# Altium schematic sheet Peryferia.SchDoc: Płytka rozwojowa STM
size A3; Author1: Łukasz Wawrzyniak; Organization: Politechnika Łódzka; Address1: WEEIA; Address2: Elektronika i Telekomunikacja; Address3: Semestr zimowy 2021/2022; Address4: Stopień II; Revision: -; SheetNumber: 7; SheetTotal: 7; Author2: Mateusz Melka; Title2: Zaawansowane narzędzia CAD/EDA; Author3: Jakub Korzeniowski; Author4: Michał Skurpel; Author5: Maciej Figiel; Index1: 239499; Index2: 239488; Index3: 239436; Index4: 239457; Index5: 239473
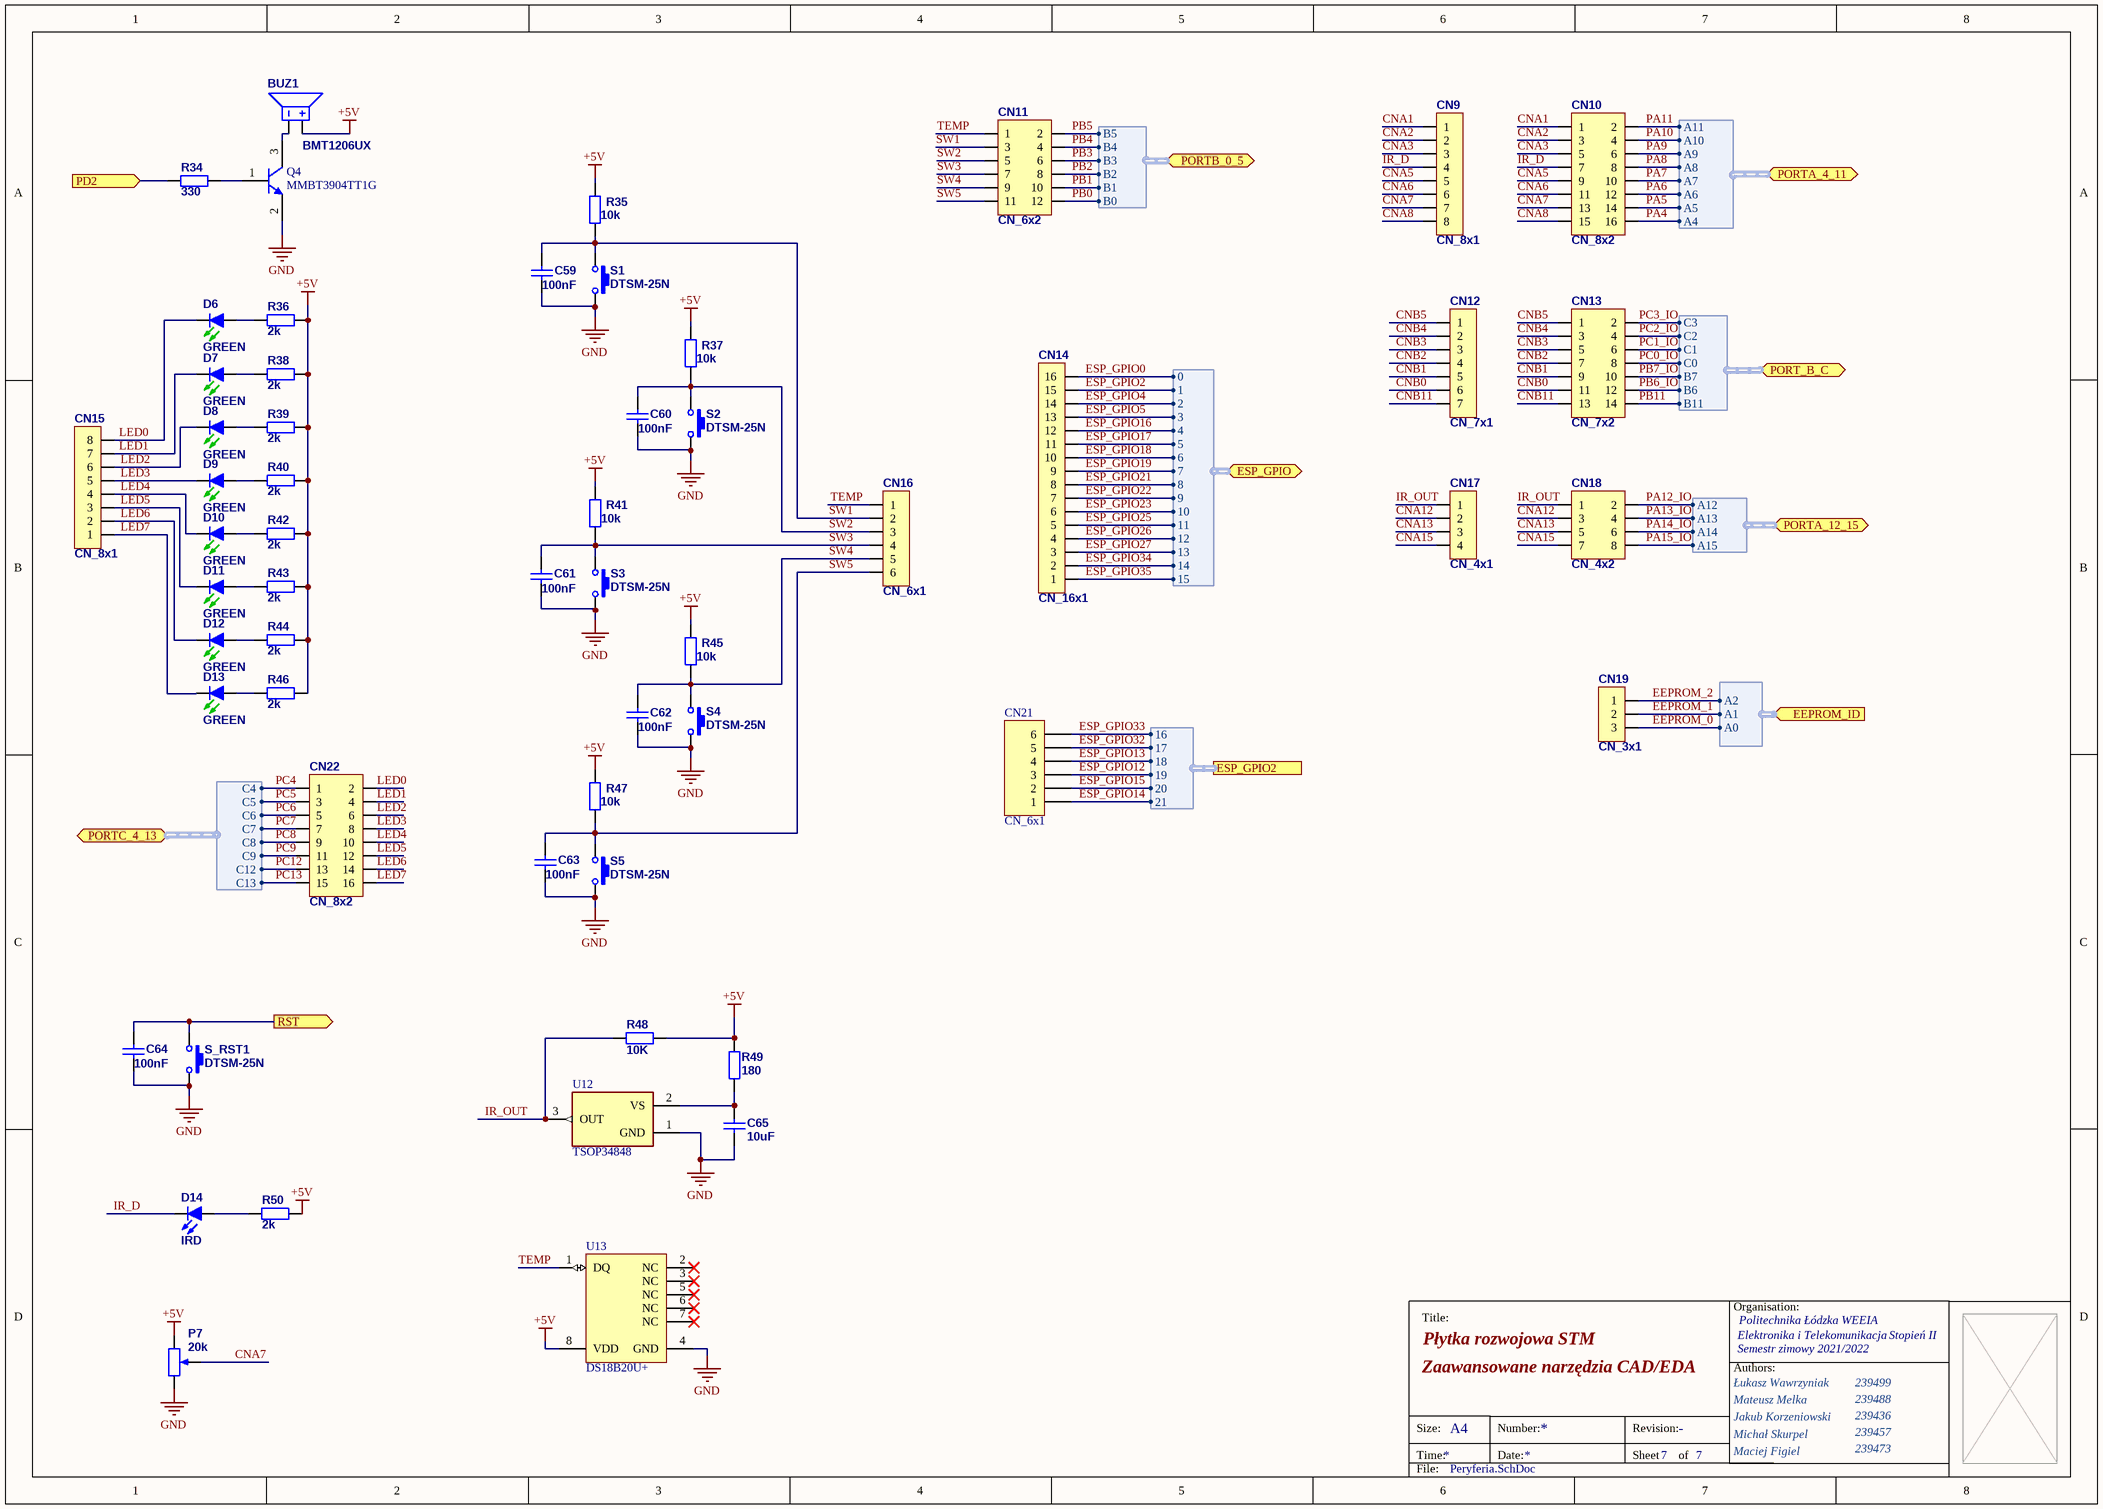
[diagram p0: Peryferia.SchDoc]

## Parts
BUZ1  BMT1206UX  [Buzzer - LD-BZEG-1305]
C59  100nF  [0805]
C60  100nF  [0805]
C61  100nF  [0805]
C62  100nF  [0805]
C63  100nF  [0805]
C64  100nF  [0805]
C65  10uF  [0805]
CN9  CN_8x1  [GP_8x1]
CN10  CN_8x2  [GP_8x2]
CN11  CN_6x2  [GP_6x2]
CN12  CN_7x1  [GP_7x1]
CN13  CN_7x2  [GP_7x2]
CN14  CN_16x1  [GP_16x1]
CN15  CN_8x1  [GP_8x1]
CN16  CN_6x1  [GP_6x1]
CN17  CN_4x1  [GP_4x1]
CN18  CN_4x2  [GP_4x2]
CN19  CN_3x1  [GP_3x1]
CN21  CN_6x1  [HDR1X6]
CN22  CN_8x2  [GP_8x2]
D6  GREEN  [LED1206G]
D7  GREEN  [LED1206G]
D8  GREEN  [LED1206G]
D9  GREEN  [LED1206G]
D10  GREEN  [LED1206G]
D11  GREEN  [LED1206G]
D12  GREEN  [LED1206G]
D13  GREEN  [LED1206G]
D14  IRD  [LED-Polarized]
P7  20k  [3305SMD]
Q4  MMBT3904TT1G  [ONSC-SC-75-3-463-01_V]
R34  330  [0805]
R35  10k  [0805]
R36  2k  [0805]
R37  10k  [0805]
R38  2k  [0805]
R39  2k  [0805]
R40  2k  [0805]
R41  10k  [0805]
R42  2k  [0805]
R43  2k  [0805]
R44  2k  [0805]
R45  10k  [0805]
R46  2k  [0805]
R47  10k  [0805]
R48  10K  [0805]
R49  180  [0805]
R50  2k  [0805]
S1  DTSM-25N  [DTSM-25N]
S2  DTSM-25N  [DTSM-25N]
S3  DTSM-25N  [DTSM-25N]
S4  DTSM-25N  [DTSM-25N]
S5  DTSM-25N  [DTSM-25N]
S_RST1  DTSM-25N  [DTSM-25N]
U12  TSOP34848  [Vishay_TSOP34838_0]
U13  DS18B20U+  [MAXM-U8+1_L]

## Ports
EEPROM_ID (in, harness Wyprowadzenia adresowe EEPROM), ESP_GPIO2 (harness GPIO ESP2), ESP_GPIO (bidir, harness GPIO ESP), PD2 (in), PORT_B_C (bidir, harness PORT_B_C), PORTA_4_11 (bidir, harness PORTA 4 11), PORTA_12_15 (bidir, harness PORTA 12 15), PORTB_0_5 (bidir, harness PORTB 0 5), PORTC_4_13 (bidir, harness PORTC 4 13), RST (out)

## Harnesses
PORTB 0 5: B0, B1, B2, B3, B4, B5
PORTC 4 13: C4, C5, C6, C7, C8, C9, C12, C13
PORTA 4 11: A4, A5, A6, A7, A8, A9, A10, A11
PORTA 12 15: A12, A13, A14, A15
Wyprowadzenia adresowe EEPROM: A0, A1, A2
GPIO ESP: 0, 1, 2, 3, 4, 5, 6, 7, 8, 9, 10, 11, 12, 13, 14, 15
PORT_B_C: B6, B7, C0, C1, C2, C3, B11
GPIO ESP2: 16, 17, 18, 19, 20, 21

## Nets
+5V: BUZ1.1 P7.2(BOT) R35.1 R36.1 R37.1 R38.1 R39.1 R40.1 R41.1 R42.1 R43.1 R44.1 R45.1 R46.1 R47.1 R48.1 R49.2 R50.1 U13.8(VDD)
GND: C59.2 C60.2 C61.2 C62.2 C63.2 C64.2 C65.1 P7.1(TOP) Q4.2(E) S1.2 S2.2 S3.2 S4.2 S5.2 S_RST1.2 U12.1(GND) U13.4(GND)
CNA1: CN9.1 CN10.1
CNA2: CN9.2 CN10.3
CNA3: CN9.3 CN10.5
CNA5: CN9.5 CN10.9
CNA6: CN9.6 CN10.11
CNA7: CN9.7 CN10.13 P7.3(TAP)
CNA8: CN9.8 CN10.15
CNA12: CN17.2 CN18.3
CNA13: CN17.3 CN18.5
CNA15: CN17.4 CN18.7
CNB0: CN12.6 CN13.11
CNB1: CN12.5 CN13.9
CNB2: CN12.4 CN13.7
CNB3: CN12.3 CN13.5
CNB4: CN12.2 CN13.3
CNB5: CN12.1 CN13.1
CNB11: CN12.7 CN13.13
EEPROM_0: CN19.3 ; port EEPROM_ID.A0
EEPROM_1: CN19.2 ; port EEPROM_ID.A1
EEPROM_2: CN19.1 ; port EEPROM_ID.A2
ESP_GPIO0: CN14.16 ; port ESP_GPIO.0
ESP_GPIO2: CN14.15 ; port ESP_GPIO.1
ESP_GPIO4: CN14.14 ; port ESP_GPIO.2
ESP_GPIO5: CN14.13 ; port ESP_GPIO.3
ESP_GPIO12: CN21.3 ; port ESP_GPIO2.19
ESP_GPIO13: CN21.4 ; port ESP_GPIO2.18
ESP_GPIO14: CN21.1 ; port ESP_GPIO2.21
ESP_GPIO15: CN21.2 ; port ESP_GPIO2.20
ESP_GPIO16: CN14.12 ; port ESP_GPIO.4
ESP_GPIO17: CN14.11 ; port ESP_GPIO.5
ESP_GPIO18: CN14.10 ; port ESP_GPIO.6
ESP_GPIO19: CN14.9 ; port ESP_GPIO.7
ESP_GPIO21: CN14.8 ; port ESP_GPIO.8
ESP_GPIO22: CN14.7 ; port ESP_GPIO.9
ESP_GPIO23: CN14.6 ; port ESP_GPIO.10
ESP_GPIO25: CN14.5 ; port ESP_GPIO.11
ESP_GPIO26: CN14.4 ; port ESP_GPIO.12
ESP_GPIO27: CN14.3 ; port ESP_GPIO.13
ESP_GPIO32: CN21.5 ; port ESP_GPIO2.17
ESP_GPIO33: CN21.6 ; port ESP_GPIO2.16
ESP_GPIO34: CN14.2 ; port ESP_GPIO.14
ESP_GPIO35: CN14.1 ; port ESP_GPIO.15
IR_D: CN9.4 CN10.7 D14.2(K)
IR_OUT: CN17.1 CN18.1 R48.2 U12.3(OUT)
LED0: CN15.8 CN22.2 D6.2(K)
LED1: CN15.7 CN22.4 D7.2(K)
LED2: CN15.6 CN22.6 D8.2(K)
LED3: CN15.5 CN22.8 D9.2(K)
LED4: CN15.4 CN22.10 D10.2(K)
LED5: CN15.3 CN22.12 D11.2(K)
LED6: CN15.2 CN22.14 D12.2(K)
LED7: CN15.1 CN22.16 D13.2(K)
PA4: CN10.16 ; port PORTA_4_11.A4
PA5: CN10.14 ; port PORTA_4_11.A5
PA6: CN10.12 ; port PORTA_4_11.A6
PA7: CN10.10 ; port PORTA_4_11.A7
PA8: CN10.8 ; port PORTA_4_11.A8
PA9: CN10.6 ; port PORTA_4_11.A9
PA10: CN10.4 ; port PORTA_4_11.A10
PA11: CN10.2 ; port PORTA_4_11.A11
PA12_IO: CN18.2 ; port PORTA_12_15.A12
PA13_IO: CN18.4 ; port PORTA_12_15.A13
PA14_IO: CN18.6 ; port PORTA_12_15.A14
PA15_IO: CN18.8 ; port PORTA_12_15.A15
PB0: CN11.12 ; port PORTB_0_5.B0
PB1: CN11.10 ; port PORTB_0_5.B1
PB2: CN11.8 ; port PORTB_0_5.B2
PB3: CN11.6 ; port PORTB_0_5.B3
PB4: CN11.4 ; port PORTB_0_5.B4
PB5: CN11.2 ; port PORTB_0_5.B5
PB6_IO: CN13.12 ; port PORT_B_C.B6
PB7_IO: CN13.10 ; port PORT_B_C.B7
PB11: CN13.14 ; port PORT_B_C.B11
PC0_IO: CN13.8 ; port PORT_B_C.C0
PC1_IO: CN13.6 ; port PORT_B_C.C1
PC2_IO: CN13.4 ; port PORT_B_C.C2
PC3_IO: CN13.2 ; port PORT_B_C.C3
PC4: CN22.1 ; port PORTC_4_13.C4
PC5: CN22.3 ; port PORTC_4_13.C5
PC6: CN22.5 ; port PORTC_4_13.C6
PC7: CN22.7 ; port PORTC_4_13.C7
PC8: CN22.9 ; port PORTC_4_13.C8
PC9: CN22.11 ; port PORTC_4_13.C9
PC12: CN22.13 ; port PORTC_4_13.C12
PC13: CN22.15 ; port PORTC_4_13.C13
PD2: R34.1 ; port PD2
RST: C64.1 S_RST1.1 ; port RST
SW1: C59.1 CN11.3 CN16.2 R35.2 S1.1
SW2: C60.1 CN11.5 CN16.3 R37.2 S2.1
SW3: C61.1 CN11.7 CN16.4 R41.2 S3.1
SW4: C62.1 CN11.9 CN16.5 R45.2 S4.1
SW5: C63.1 CN11.11 CN16.6 R47.2 S5.1
TEMP: CN11.1 CN16.1 U13.1(DQ)
NetBUZ1_2: BUZ1.2 Q4.3(C)
NetC65_2: C65.2 R49.1 U12.2(VS)
NetD6_1: D6.1(A) R36.2
NetD7_1: D7.1(A) R38.2
NetD8_1: D8.1(A) R39.2
NetD9_1: D9.1(A) R40.2
NetD10_1: D10.1(A) R42.2
NetD11_1: D11.1(A) R43.2
NetD12_1: D12.1(A) R44.2
NetD13_1: D13.1(A) R46.2
NetD14_1: D14.1(A) R50.2
NetQ4_1: Q4.1(B) R34.2

Not connected (* = marked no-connect by the designer): U13 2(NC)* 3(NC)* 5(NC)* 6(NC)* 7(NC)*

## Notes on the sheet
- Title:
- Organisation:
- Authors:
- Size:
- Time:
- A4
- Number:
- Date:
- Revision:
- Sheet
- of
- File:

## Library data of the parts
BUZ1 = BMT1206UX: Buzzer
C59-C65 = Cap: Capacitor; ComponentLink1Description: datasheet; ComponentLink2Description: supplier
  C59-C64: Value: 100nF
  C65: Value: 10uF
CN21 = Header 6: Header, 6-Pin; LatestRevisionDate: 17-Jul-2002; LatestRevisionNote: Re-released for DXP Platform.; Publisher: Altium Limited
D6-D13 = LED_GREEN: GREEN LED; Product Nr: KP-3216SGD; Voltage: 2,2-2,5V; Light Angle: 120; Brightness: 3,2÷12,5mcd; Current: 20mA; Published: 04-Apr-2006; Supplier: KINGBRIGHT ELECTRONIC
D14 = LED: Typical RED, GREEN, YELLOW, AMBER GaAs LED; Published: 04-Apr-2006
P7 = 3305SMD-10K: Published: 21-10-2009; ComponentLink1Description: datasheet; ComponentLink2Description: supplier; Value: 20k
Q4 = CMP-1048-00420-1: General Purpose Transistor, NPN Silicon, 3-Pin SC-75, Pb-Free, Tape and Reel; Manufacturer: On Semiconductor; IC Continuous (A): 0.2; fT Min (MHz): 300; ComponentLink3URL: http://www.onsemi.com/pub_link/Collateral/463-01.PDF; DatasheetVersion: Rev. 5; RoHS: TRUE; Mounting Technology: Surface Mount; ComponentLink1URL: http://www.onsemi.com/; ComponentLink3Description: Package Specification; PackageReference: SC-75-3-463-01; Polarity: NPN; ComponentLink2Description: Datasheet; PackageVersion: Rev. F, 07/2005; PartNumber: MMBT3904TT1G; ComponentLink2URL: http://www.onsemi.cn/pub_link/Collateral/MMBT3904TT1-D.PDF; ComponentLink1Description: Manufacturer URL; PackageDescription: 3-Pin Small Outline Transistor, Body 1.6 x 0.8 mm, Pitch 0.5 mm; Packing: Tape and Reel
R34-R50 = Res: Resistor; Published: 19-Feb-2006; ComponentLink1Description: datasheet; ComponentLink2Description: supplier
  R34: Value: 330
  R35 R37 R41 R45 R47: Value: 10k
  R36 R38-R40 R42-R44 R46 R50: Value: 2k
  R48: Value: 10K
  R49: Value: 180
S1-S5 S_RST1 = DTSM-25N: DIPTRONICS Brown 12x12mm SMD Tactile SPST-NO Switch; Supplier 1: TME; Supplier Part Number 1: DTSM-25N-V-B
U12 = TSOP31236: Remote Receiver Sensor, 36.0kHz 45m Through Hole; MF: Vishay Semiconductor; SnapEDA_Link: https://www.snapeda.com/parts/TSOP31236/Vishay%20Semiconductor%20Opto%20Division/view-part/266363/?ref=snap; Value: *; Price: None; Availability: Unavailable; MP: TSOP31236; Package: None
U13 = CMP-0253-00036-2: High-Precision 1-Wire Digital Thermometer, -55 to 125 degC, 8-Pin SOP (U8+1), Pb-Free; Sensor Type: Local; Multi Droppable: Yes; Temp. Thresh.: Programmable (NV); PackageVersion: Rev. L, 08/2009; Generic Part Number: DS18B20; PackageReference: U8+1; PackageDescription: 8-Pin Micro-MAX, Thin Shrink Small-Outline (U8+1), Body 3 x 3 mm, Pitch 0.65 mm; ComponentLink3URL: http://pdfserv.maximintegrated.com/package_dwgs/21-0036.PDF; Code_JEDEC: MO-187; DatasheetVersion: Rev. 4; ComponentLink1Description: Manufacturer URL; Mounting Technology: Surface Mount; ComponentLink1URL: http://www.maximintegrated.com/; Parasite Pwr.: Yes; RoHS: Pb-Free; ComponentLink2URL: http://datasheets.maximintegrated.com/en/ds/DS18B20.pdf; ComponentLink2Description: Datasheet; Interface: 1-Wire; PartNumber: DS18B20U+; ComponentLink3Description: Package Specification